# Altium schematic sheet 07-multimodal-microcontroller.SchDoc
size A3; SheetNumber: 5; SheetTotal: 11
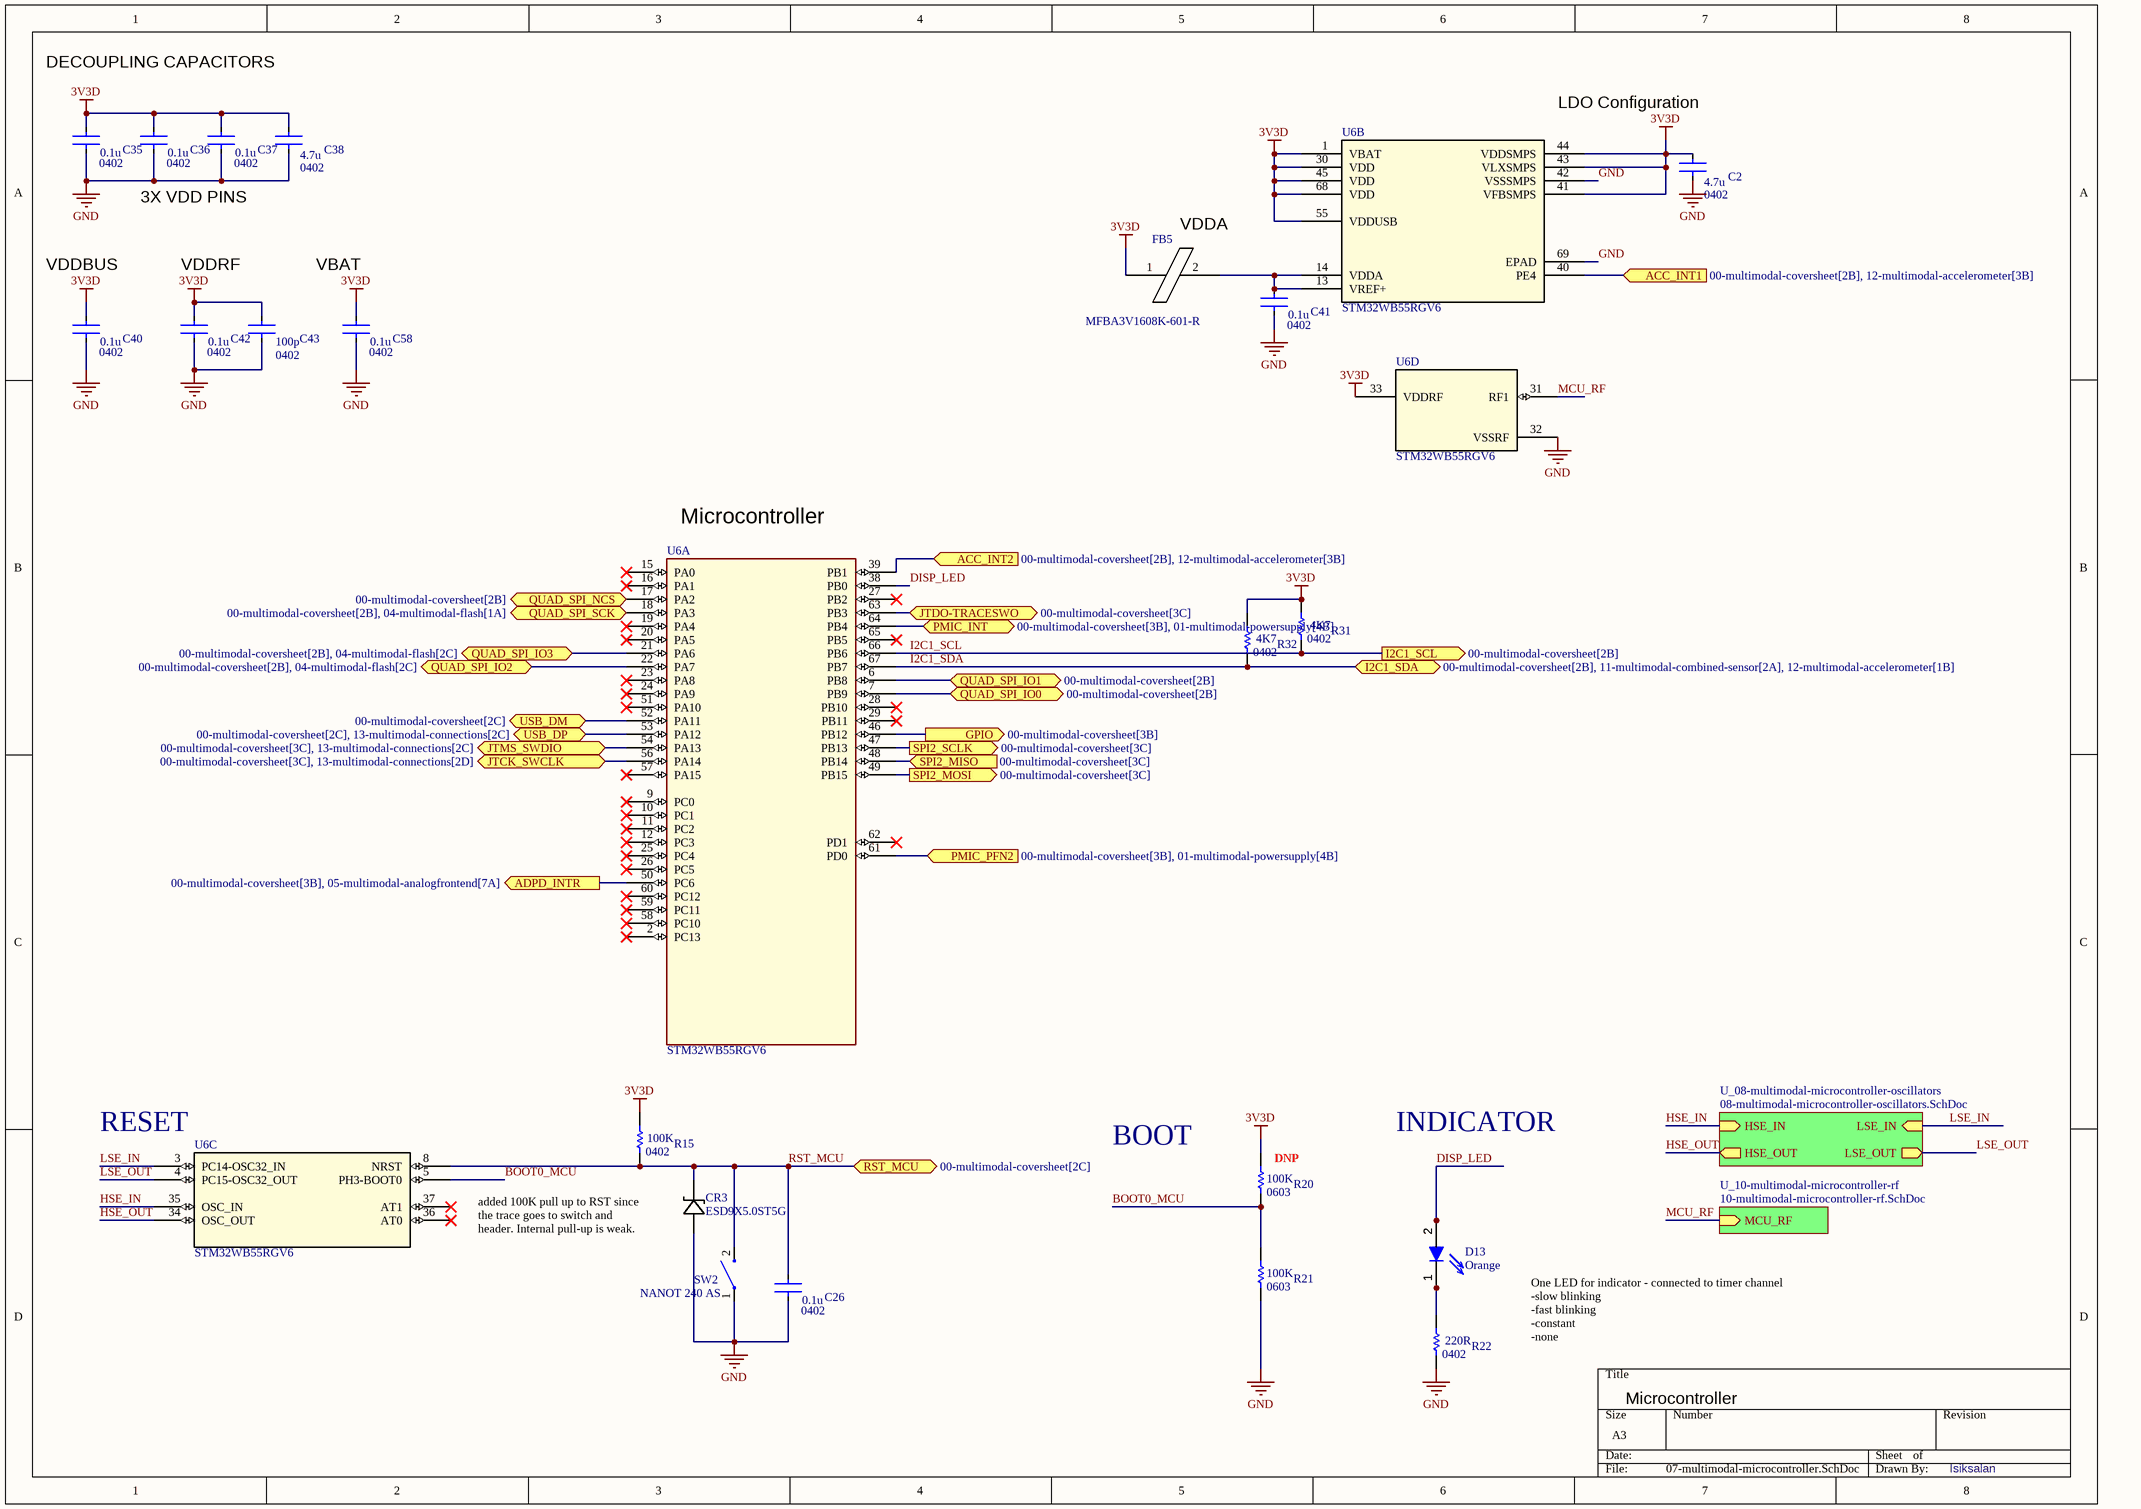
[diagram p0: 07-multimodal-microcontroller.SchDoc]

## Parts
C2  C1005X5R1A475K050BC  [CAPTDK0402]  (value not drawn)
C26  C1005X7R1H104K050BB  [CAPTDK0402]  (value not drawn)
C35  C1005X7R1H104K050BB  [CAPTDK0402]  (value not drawn)
C36  C1005X7R1H104K050BB  [CAPTDK0402]  (value not drawn)
C37  C1005X7R1H104K050BB  [CAPTDK0402]  (value not drawn)
C38  C1005X5R1A475K050BC  [CAPTDK0402]  (value not drawn)
C40  C1005X7R1H104K050BB  [CAPTDK0402]  (value not drawn)
C41  C1005X7R1H104K050BB  [CAPTDK0402]  (value not drawn)
C42  C1005X7R1H104K050BB  [CAPTDK0402]  (value not drawn)
C43  CGA2B2C0G1H101J050BA  [CAPTDK0402]  (value not drawn)
C58  C1005X7R1H104K050BB  [CAPTDK0402]  (value not drawn)
CR3  ESD9X5.0ST5G  [SOD-923_514AB_ONS]
D13  Orange  [DISPLAY-LED]
FB5  MFBA3V1608K-601-R  [INDMURT0603]
R15  RMCF0402FT100K  [RES-STACK-POLE-0402]  (value not drawn)
R20  RMCF0603JG100K  [RES-STACK-POLE-0603]  (value not drawn)  (no BOM)
R21  RMCF0603JG100K  [RES-STACK-POLE-0603]  (value not drawn)
R22  RMCF0402JT220R  [RES-STACK-POLE-0402]  (value not drawn)
R31  RMCF0402FT4K70  [RES-STACK-POLE-0402]  (value not drawn)
R32  RMCF0402FT4K70  [RES-STACK-POLE-0402]  (value not drawn)
SW2  NANOT 240 AS  [TACTILE-SWITCH - TINY]
U6  STM32WB55RGV6  [STM32WB55RG]  (parts A,B,C,D of 4)

## Sub-sheets
U_08-multimodal-microcontroller-oscillators = 08-multimodal-microcontroller-oscillators.SchDoc: LSE_IN (in), LSE_OUT (out), HSE_IN (in), HSE_OUT (out)
U_10-multimodal-microcontroller-rf = 10-multimodal-microcontroller-rf.SchDoc: MCU_RF (in)

## Ports
ACC_INT1 (in, see 00-multimodal-coversheet[2B], 12-multimodal-accelerometer[3B]), ACC_INT2 (in, see 00-multimodal-coversheet[2B], 12-multimodal-accelerometer[3B]), ADPD_INTR (out, see 00-multimodal-coversheet[3B], 05-multimodal-analogfrontend[7A]), GPIO (out, see 00-multimodal-coversheet[3B]), I2C1_SCL (out, see 00-multimodal-coversheet[2B]), I2C1_SDA (bidir, see 00-multimodal-coversheet[2B], 11-multimodal-combined-sensor[2A], 12-multimodal-accelerometer[1B]), JTCK_SWCLK (bidir, see 00-multimodal-coversheet[3C], 13-multimodal-connections[2D]), JTDO-TRACESWO (bidir, see 00-multimodal-coversheet[3C]), JTMS_SWDIO (bidir, see 00-multimodal-coversheet[3C], 13-multimodal-connections[2C]), PMIC_INT (bidir, see 00-multimodal-coversheet[3B], 01-multimodal-powersupply[4B]), PMIC_PFN2 (in, see 00-multimodal-coversheet[3B], 01-multimodal-powersupply[4B]), QUAD_SPI_IO0 (bidir, see 00-multimodal-coversheet[2B]), QUAD_SPI_IO1 (bidir, see 00-multimodal-coversheet[2B]), QUAD_SPI_IO2 (bidir, see 00-multimodal-coversheet[2B], 04-multimodal-flash[2C]), QUAD_SPI_IO3 (bidir, see 00-multimodal-coversheet[2B], 04-multimodal-flash[2C]), QUAD_SPI_NCS (bidir, see 00-multimodal-coversheet[2B]), QUAD_SPI_SCK (bidir, see 00-multimodal-coversheet[2B], 04-multimodal-flash[1A]), RST_MCU (bidir, see 00-multimodal-coversheet[2C]), SPI2_MISO (in, see 00-multimodal-coversheet[3C]), SPI2_MOSI (out, see 00-multimodal-coversheet[3C]), SPI2_SCLK (out, see 00-multimodal-coversheet[3C]), USB_DM (bidir, see 00-multimodal-coversheet[2C]), USB_DP (bidir, see 00-multimodal-coversheet[2C], 13-multimodal-connections[2C])

## Nets
3V3D: C2.1 C35.1 C36.1 C37.1 C38.1 C40.1 C42.1 C43.1 C58.1 FB5.1 R15.2 R20.2 R31.2 R32.2 U6.1(VBAT) U6.30(VDD) U6.33(VDDRF) U6.41(VFBSMPS) U6.43(VLXSMPS) U6.44(VDDSMPS) U6.45(VDD) U6.55(VDDUSB) U6.68(VDD)
GND: C2.2 C26.2 C35.2 C36.2 C37.2 C38.2 C40.2 C41.2 C42.2 C43.2 C58.2 CR3.2 R21.1 R22.1 SW2.1 U6.32(VSSRF) U6.42(VSSSMPS) U6.69(EPAD)
ACC_INT1: U6.40(PE4) ; port ACC_INT1
ACC_INT2: U6.39(PB1) ; port ACC_INT2
ADPD_INTR: U6.50(PC6) ; port ADPD_INTR
BOOT0_MCU: R20.1 R21.2 U6.5(PH3-BOOT0)
DISP_LED: D13.2 U6.38(PB0)
GPIO: U6.46(PB12) ; port GPIO
HSE_IN: U6.35(OSC_IN) ; sheet U_08-multimodal-microcontroller-oscillators/HSE_IN
HSE_OUT: U6.34(OSC_OUT) ; sheet U_08-multimodal-microcontroller-oscillators/HSE_OUT
I2C1_SCL: R31.1 U6.66(PB6) ; port I2C1_SCL
I2C1_SDA: R32.1 U6.67(PB7) ; port I2C1_SDA
JTCK_SWCLK: U6.56(PA14) ; port JTCK_SWCLK
JTDO-TRACESWO: U6.63(PB3) ; port JTDO-TRACESWO
JTMS_SWDIO: U6.54(PA13) ; port JTMS_SWDIO
LSE_IN: U6.3(PC14-OSC32_IN) ; sheet U_08-multimodal-microcontroller-oscillators/LSE_IN
LSE_OUT: U6.4(PC15-OSC32_OUT) ; sheet U_08-multimodal-microcontroller-oscillators/LSE_OUT
MCU_RF: U6.31(RF1) ; sheet U_10-multimodal-microcontroller-rf/MCU_RF
PMIC_INT: U6.64(PB4) ; port PMIC_INT
PMIC_PFN2: U6.61(PD0) ; port PMIC_PFN2
QUAD_SPI_IO0: U6.7(PB9) ; port QUAD_SPI_IO0
QUAD_SPI_IO1: U6.6(PB8) ; port QUAD_SPI_IO1
QUAD_SPI_IO2: U6.22(PA7) ; port QUAD_SPI_IO2
QUAD_SPI_IO3: U6.21(PA6) ; port QUAD_SPI_IO3
QUAD_SPI_NCS: U6.17(PA2) ; port QUAD_SPI_NCS
QUAD_SPI_SCK: U6.18(PA3) ; port QUAD_SPI_SCK
RST_MCU: C26.1 CR3.1 R15.1 SW2.2 U6.8(NRST) ; port RST_MCU
SPI2_MISO: U6.48(PB14) ; port SPI2_MISO
SPI2_MOSI: U6.49(PB15) ; port SPI2_MOSI
SPI2_SCLK: U6.47(PB13) ; port SPI2_SCLK
USB_DM: U6.52(PA11) ; port USB_DM
USB_DP: U6.53(PA12) ; port USB_DP
NetC41_1: C41.1 FB5.2 U6.13(VREF+) U6.14(VDDA)
NetD13_1: D13.1 R22.2

Not connected (* = marked no-connect by the designer): U6 2(PC13)* 9(PC0)* 10(PC1)* 11(PC2)* 12(PC3)* 15(PA0)* 16(PA1)* 19(PA4)* 20(PA5)* 23(PA8)* 24(PA9)* 25(PC4)* 26(PC5)* 27(PB2)* 28(PB10)* 29(PB11)* 36(AT0)* 37(AT1)* 51(PA10)* 57(PA15)* 58(PC10)* 59(PC11)* 60(PC12)* 62(PD1)* 65(PB5)*

## Notes on the sheet
- DECOUPLING CAPACITORS
- LDO Configuration
- 3X VDD PINS
- (near FB5) VDDA
- (near C40) VDDBUS
- VDDRF
- VBAT
- (near U6) Microcontroller
- (near U6) RESET
- BOOT
- (near R20) DNP
- INDICATOR
- added 100K pull up to RST since the trace goes to switch and header. Internal pull-up is weak.
- One LED for indicator - connected to timer channel
  -slow blinking
  -fast blinking
  -constant
  -none
- Microcontroller
- Isiksalan
- (in symbol C1005X5R1A475K050BC) 4.7u; 0402
- (in symbol C1005X7R1H104K050BB) 0.1u; 0402
- (in symbol CGA2B2C0G1H101J050BA_1) 100p; 0402
- (in symbol RMCF0402FT4K70) 4K7; 0402
- (in symbol RMCF0402FT100K) 100K; 0402
- (in symbol RMCF0402JT220R) 220R; 0402
- (in symbol RMCF0603JG100K) 100K; 0603

## Library data of the parts
C2 C38 = C1005X5R1A475K050BC: CAP CER 4.7UF 10V X5R 0402; Supplier 1: Digi-Key; Supplier Part Number 1: 445-13820-1-ND
C26 C35-C37 C40-C42 C58 = C1005X7R1H104K050BB: CAP CER 0.1UF 50V X7R 0402; Supplier 1: Digi-Key; Supplier Part Number 1: 445-5932-1-ND
C43 = CGA2B2C0G1H101J050BA_1: CAP CER 100PF 50V C0G 0402; Supplier 1: Digi-Key; Supplier Part Number 1: 445-5596-1-ND
CR3 = ESD9X5.0ST5G: TVS DIODE 5VWM 12.3VC SOD923; Manufacturer_Name: onsemi; Copyright: Copyright (C) 2026 Ultra Librarian. All rights reserved.; Manufacturer_Part_Number: ESD9X5.0ST5G; Supplier 1: Avnet; Supplier Part Number 1: ESD9X5.0ST5G
D13 = LTST-C191KFKT: LED ORANGE CLEAR 0603 SMD; Supplier 1: Digi-Key; Supplier Part Number 1: 160-1445-1-ND
FB5 = MFBA3V1608K-601-R: FERRITE BEAD 600 OHM 0603 1LN; Supplier 1: DigiKey; Supplier Part Number 1: 283-MFBA3V1608K-601-RCT-ND
R15 = RMCF0402FT100K: RES 100K OHM 1% 1/16W 0402; Supplier 1: Digi-Key; Supplier Part Number 1: RMCF0402FT100KCT-ND
R20 R21 = RMCF0603JG100K: RES 100K OHM 5% 1/10W 0603; Supplier 1: DigiKey; Supplier Part Number 1: RMCF0603JG100KCT-ND
R22 = RMCF0402JT220R: RES 220 OHM 5% 1/16W 0402; Supplier 1: Digi-Key; Supplier Part Number 1: RMCF0402JT220RCT-ND
R31 R32 = RMCF0402FT4K70: RES 4.7K OHM 1% 1/16W 0402; Supplier 1: Digi-Key; Supplier Part Number 1: RMCF0402FT4K70CT-ND
SW2 = NANOT 240 AS: SWITCH TACTILE SPST-NO 0.02A 15V; Supplier 1: Future Electronics; Supplier Part Number 1: 2189518
U6 = STM32WB55RGV6: Ultra-low-power dual core Arm Cortex-M4 MCU 64 MHz, Cortex-M0+ 32 MHz with 1 Mbyte of Flash memory, Bluetooth LE 5.4, 802.15.4, Zigbee, Thread, Matter, USB, LCD, AES-256; Manufacturer_Name: STMicroelectronics; Copyright: Copyright (C) 2025 Ultra Librarian. All rights reserved.; Manufacturer_Part_Number: STM32WB55RGV6; RefDes: RefDes; Type: Type